# EasyEDA Pro project 2025智能物流搬运_PCB_XAUT_20250927.eprj, schematic Schematic12_1
Board Name: 主控板扩展版_1.1; Create Date: 2025-06-24; Page Name: P1; Project Name: 物流车底盘测试; Schematic Name: Schematic12_1; Update Date: 2025-06-24; Company: 嘉立创EDA; Page Size: A4; Version: V1.0
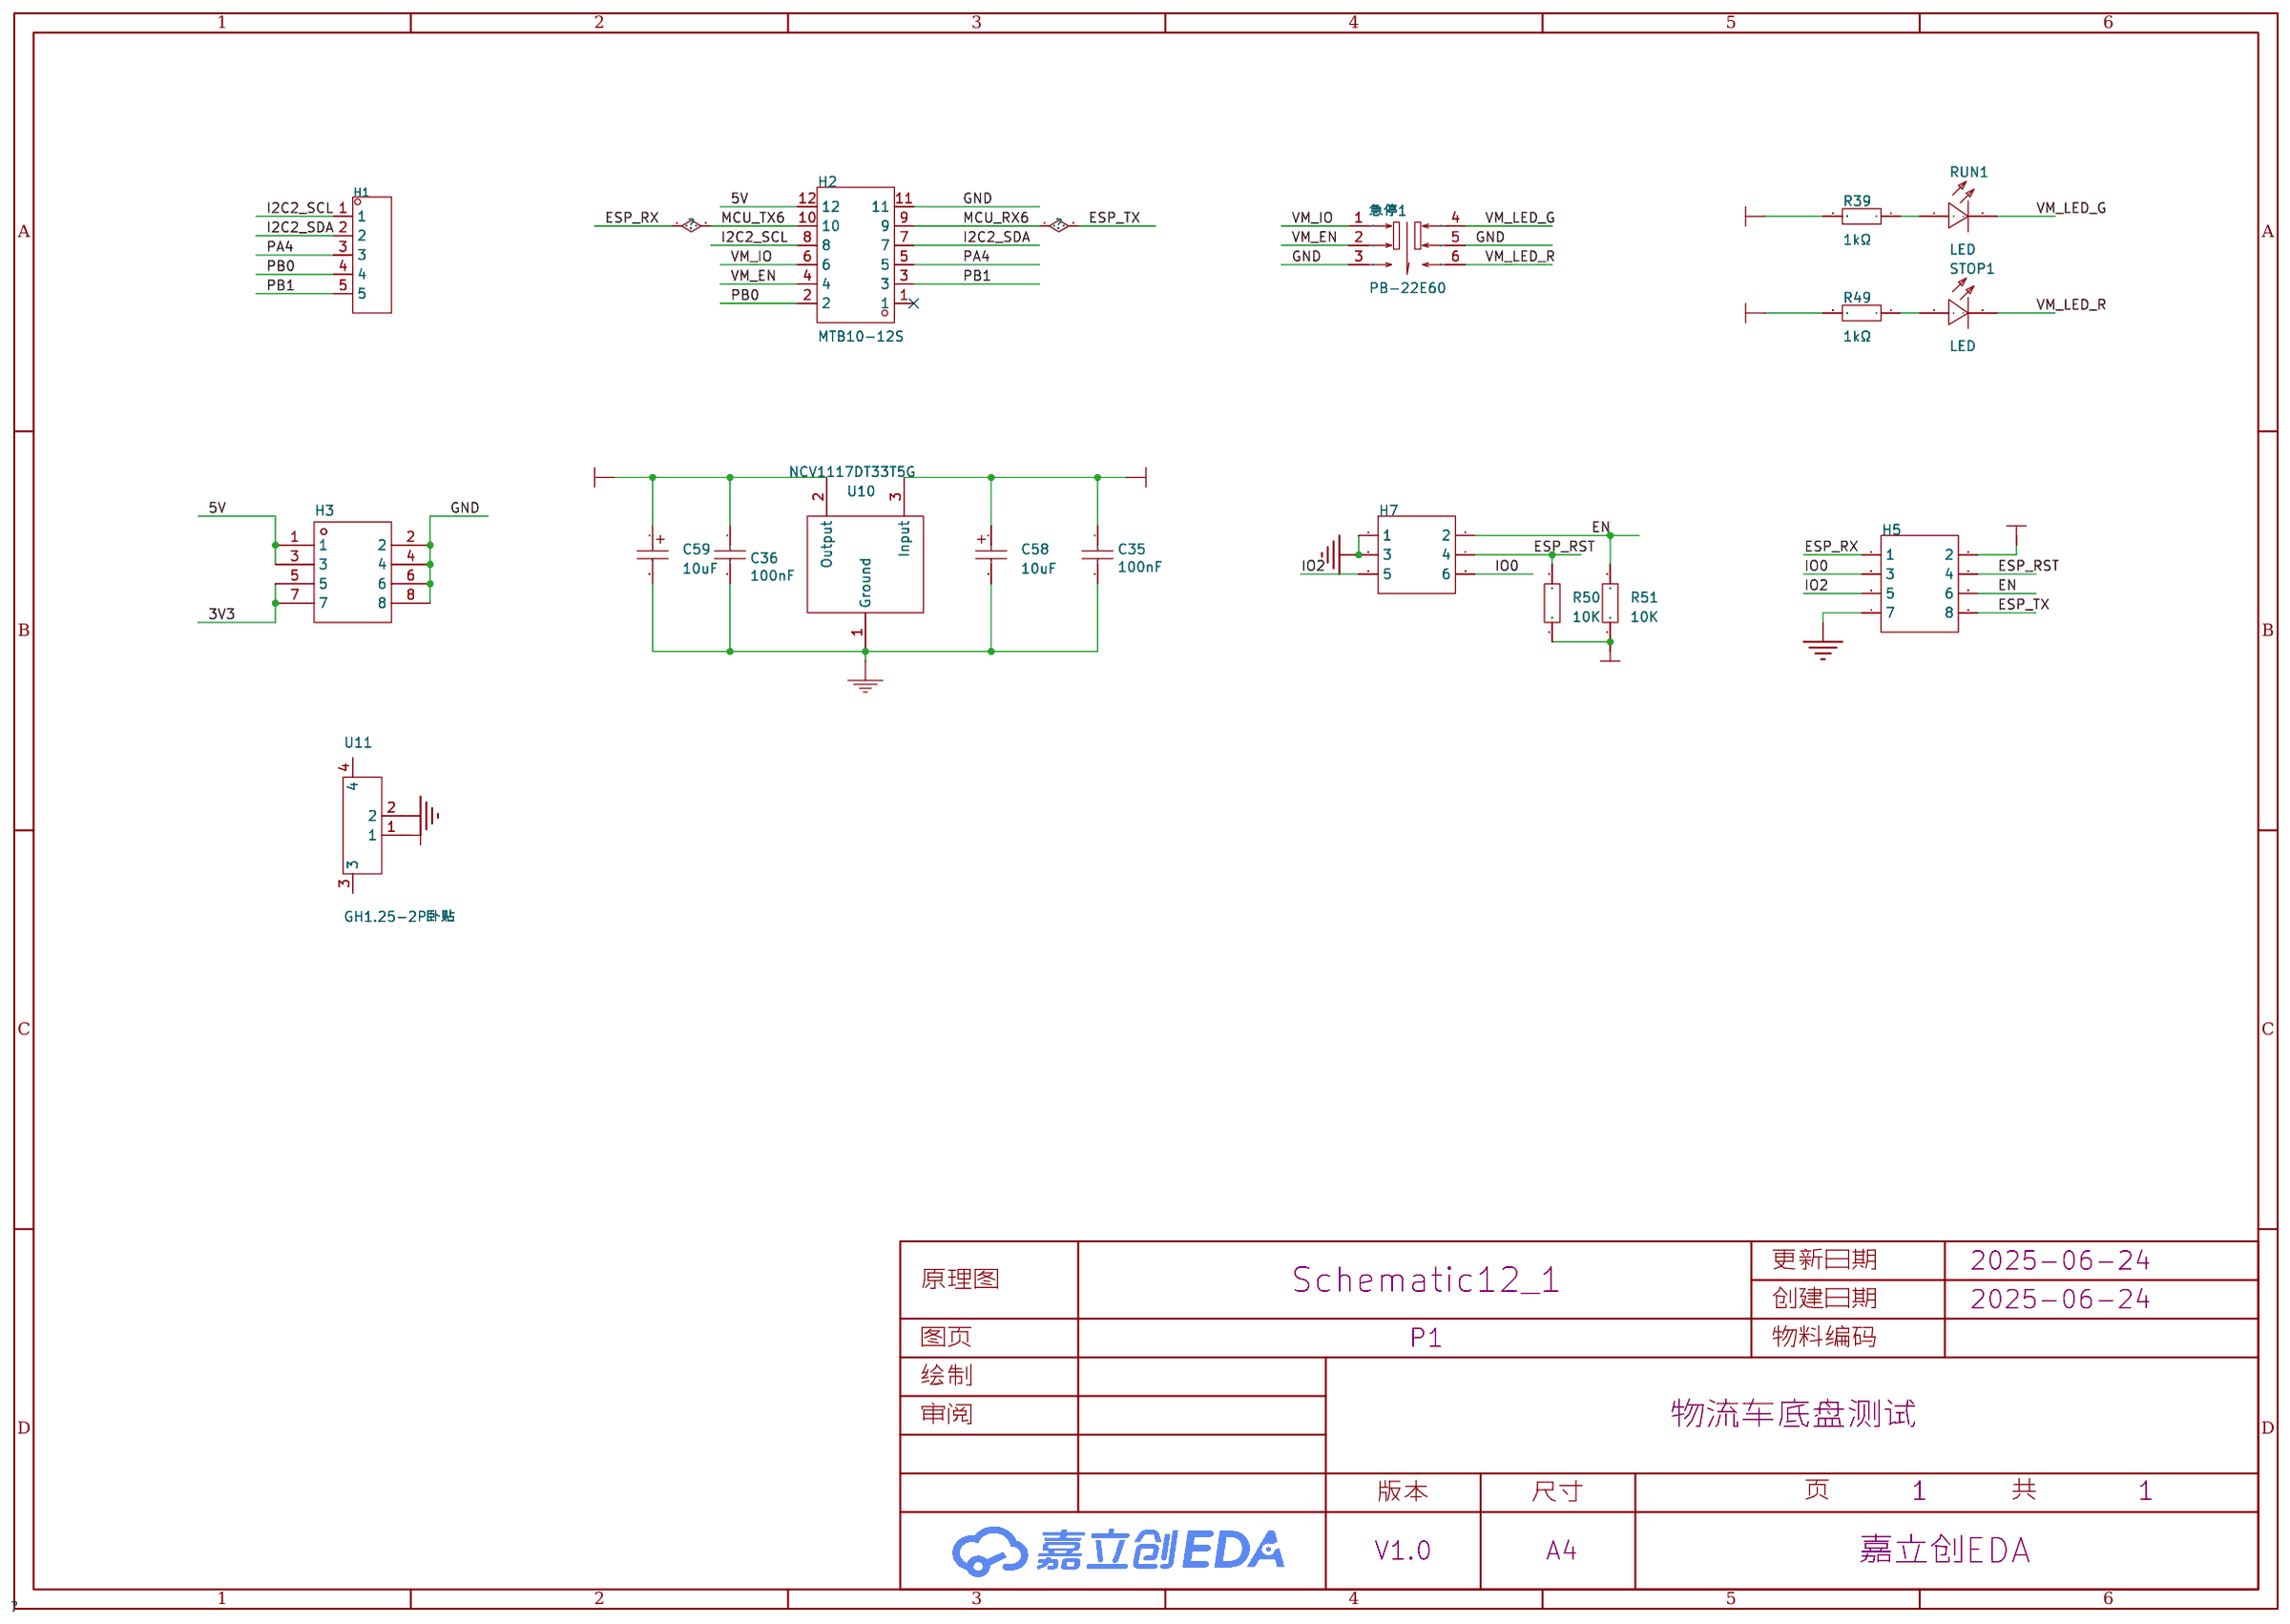
[diagram p1: schematic sheet]

## Parts
C35  100nF  [C0603]
C36  100nF  [C0603]
C58  10uF  [CAP-SMD_L3.2-W1.6-RD-C7171]
C59  10uF  [CASE-A_3216]
H1  -  [HDR-TH_5P-P2.54-V-M]
H2  MTB10-12S  [CONN-TH_12P-P2.54_MTB10-12S]
H3  -  [HDR-TH_8P-P2.54-V-M-R2-C4-S2.54]
H5  -  [HDR-TH_8P-P2.54-V-F-R2-C4-S2.54-1]
H7  -  [HDR-TH_6P-P2.54-V-R2-C3-S2.54_A2541WV-2X3P]
R39  1kΩ  [R0603]
R49  1kΩ  [R0603]
R50  10K  [R0603]
R51  10K  [R0603]
RUN1  LED  [LED-TH_BD4.0-P2.54-FD_RED]
STOP1  LED  [LED-TH_BD4.0-P2.54-FD_RED]
U10  NCV1117DT33T5G  [TO-252-3_L6.5-W5.8-P4.58-BR]
U11  GH1.25-2P卧贴  [CONN-SMD_2P-P1.25_GH1.25-2P]
急停1  PB-22E60  [SW-TH_6P-L5.8-W5.8-P2.00-LS4.5-TL]

## Library data of the parts
C35 C36 = 100nF: link: https://item.szlcsc.com/362304.html; 3DModel: C0603_L1.6-W0.8-H0.8; Supplier: LCSC; Manufacturer: FH(风华); Manufacturer Part: 0603B104K500NT; Supplier Part: C30926; JLCPCB Part Class: Extended Part
C58 = TAJA106K016RNJ: 容值:10uF;精度:±10%;额定电压:16V;等效串联电阻:3Ω@100kHz;; LCSC Part Name: 10uF ±10% 16V; Supplier Part: C7171; Manufacturer: Kyocera AVX; Supplier Footprint: CASE-A-3216; Datasheet: https://atta.szlcsc.com/upload/public/pdf/source/20160107/1457707750344.pdf; Supplier: LCSC; Tolerance: ±10%; Rated Voltage: 16V; Equivalent Series Resistance(ESR): 3Ω@100kHz; Operating Temperature: -55℃~+125℃
C59 = CA45-A-10V-22uF-K: 容值:22uF;精度:±10%;额定电压:10V;等效串联电阻:10Ω@100kHz;; LCSC Part Name: 22uF ±10% 10V; Supplier Part: C129272; Manufacturer: CEC(振华新云); Supplier Footprint: CASE-A-3216; Datasheet: https://atta.szlcsc.com/upload/public/pdf/source/20170914/C129272_1505359928095968134.pdf; Supplier: LCSC; Tolerance: ±10%; Rated Voltage: 10V; Equivalent Series Resistance(ESR): 10Ω@100kHz; Operating Temperature: -55℃~+125℃
H1 = HDR-M_2.54_1x5P: Supplier Part: C358687; Supplier Footprint: 插件
H2 = MTB10-12S: Supplier Part: C3148238; Manufacturer: MINTRON(明硕); Supplier Footprint: 插件,P=2.54mm; Datasheet: https://atta.szlcsc.com/upload/public/pdf/source/20220705/35161231C53940228D3017974FD3B995.pdf; Supplier: LCSC; Holder Type: 直插
H3 = HDR-M_2.54_2x4: Supplier Part: C124386; Supplier Footprint: 插件,P=2.54mm
H5 = HDR-F_2.54_2x4: Supplier Part: C92271; Supplier Footprint: 插件
H7 = HDR-M_2.54_2x3: Supplier Part: C402781; Supplier Footprint: 插件,P=2.54mm
R39 R49 = 2kΩ: link: https://www.mouser.in/datasheet/2/447/PYu_RT_1_to_0_01_RoHS_L_11-1669912.pdf; Supplier: LCSC; Manufacturer: UNI-ROYAL(厚声); Manufacturer Part: 0603WAF2001T5E; Supplier Part: C22975; JLCPCB Part Class: Basic Part
R50 R51 = Res_0603: Supplier Footprint: 0603
RUN1 STOP1 = LED: Supplier Part: C9900015665; Supplier Footprint: SIP-2P; JLCPCB Part Class: 扩展库; Supplier: LCSC
U10 = NCV1117DT33T5G: 输出类型:固定;最大输入电压:20V;输出电压:3.3V;最大输出电流:1A;电源纹波抑制比(PSRR):64dB@(120Hz);输出极性:正极;; LCSC Part Name: 输入20V 输出3.3V 1A; Supplier Part: C20625; Manufacturer: onsemi(安森美); Supplier Footprint: TO-252-2(DPAK); Datasheet: https://atta.szlcsc.com/upload/public/pdf/source/20140228/1457706997274.pdf; Supplier: LCSC; Output Type: 固定; Maximum Input Voltage: 20V; Output Voltage: 3.3V; MAX Output Current: 1A; Power Supply Rejection Ratio (PSRR): 64dB@(120Hz); Dropout Voltage: 1.2V@(800mA); standby current: 10mA; Operating Temperature: -40℃~+125℃@(Ta); Output Polarity: 正极; Number of Outputs: 1
U11 = GH1.25-2P卧贴: Supplier Part: C9900014668; JLCPCB Part Class: 扩展库; Supplier: LCSC
急停1 = PB-22E60: LCSC Part Name: 自锁按键开关; Supplier Part: C2904927; Manufacturer: DEALON(德艺隆); Supplier Footprint: 插件; JLCPCB Part Class: 扩展库; Datasheet: https://atta.szlcsc.com/upload/public/pdf/source/20211110/94BD6F135812D35890A27986BB24FE78.pdf; Supplier: LCSC; Circuit: 双刀双掷; Actuator Style: 矩形柱塞; Mounting Style: 直插; Actuator/Cap Color: 白色; Pin Style: PC引脚; Operating Force: 180gf

## Nets
3V3: C36.1 C59.1 H3.5 H3.7 H5.2 R39.2 R49.2 R50.1 R51.1 U10.2(Output)
5V: C35.1 C58.1 H2.12 H3.1 H3.3 U10.3(Input) U11.1
GND: C35.2 C36.2 C58.2 C59.2 H2.11 H3.2 H3.4 H3.6 H3.8 H5.7 H7.1 H7.3 U10.1(Ground) U11.2 急停1.3(NO) 急停1.5(COM)
EN: H5.6 H7.2 R51.2
ESP_RST: H5.4 H7.4 R50.2
ESP_RX: H2.10 H5.1
ESP_TX: H2.9 H5.8
I2C2_SCL: H1.1 H2.8
I2C2_SDA: H1.2 H2.7
IO0: H5.3 H7.6
IO2: H5.5 H7.5
PA4: H1.3 H2.5
PB0: H1.4 H2.2
PB1: H1.5 H2.3
VM_EN: H2.4 急停1.2(COM)
VM_IO: H2.6 急停1.1(NC)
VM_LED_G: RUN1.2(-) 急停1.4(NC)
VM_LED_R: STOP1.2(-) 急停1.6(NO)
$1N1817: R39.1 RUN1.1(+)
$1N1818: R49.1 STOP1.1(+)

Not connected (* = marked no-connect by the designer): H2 1*; U11 3 4
